# Altium schematic sheet 24. SOC DIGITAL POWER 3.SchDoc: SOC - DIGITAL POWER 3 (part 3 of 5)
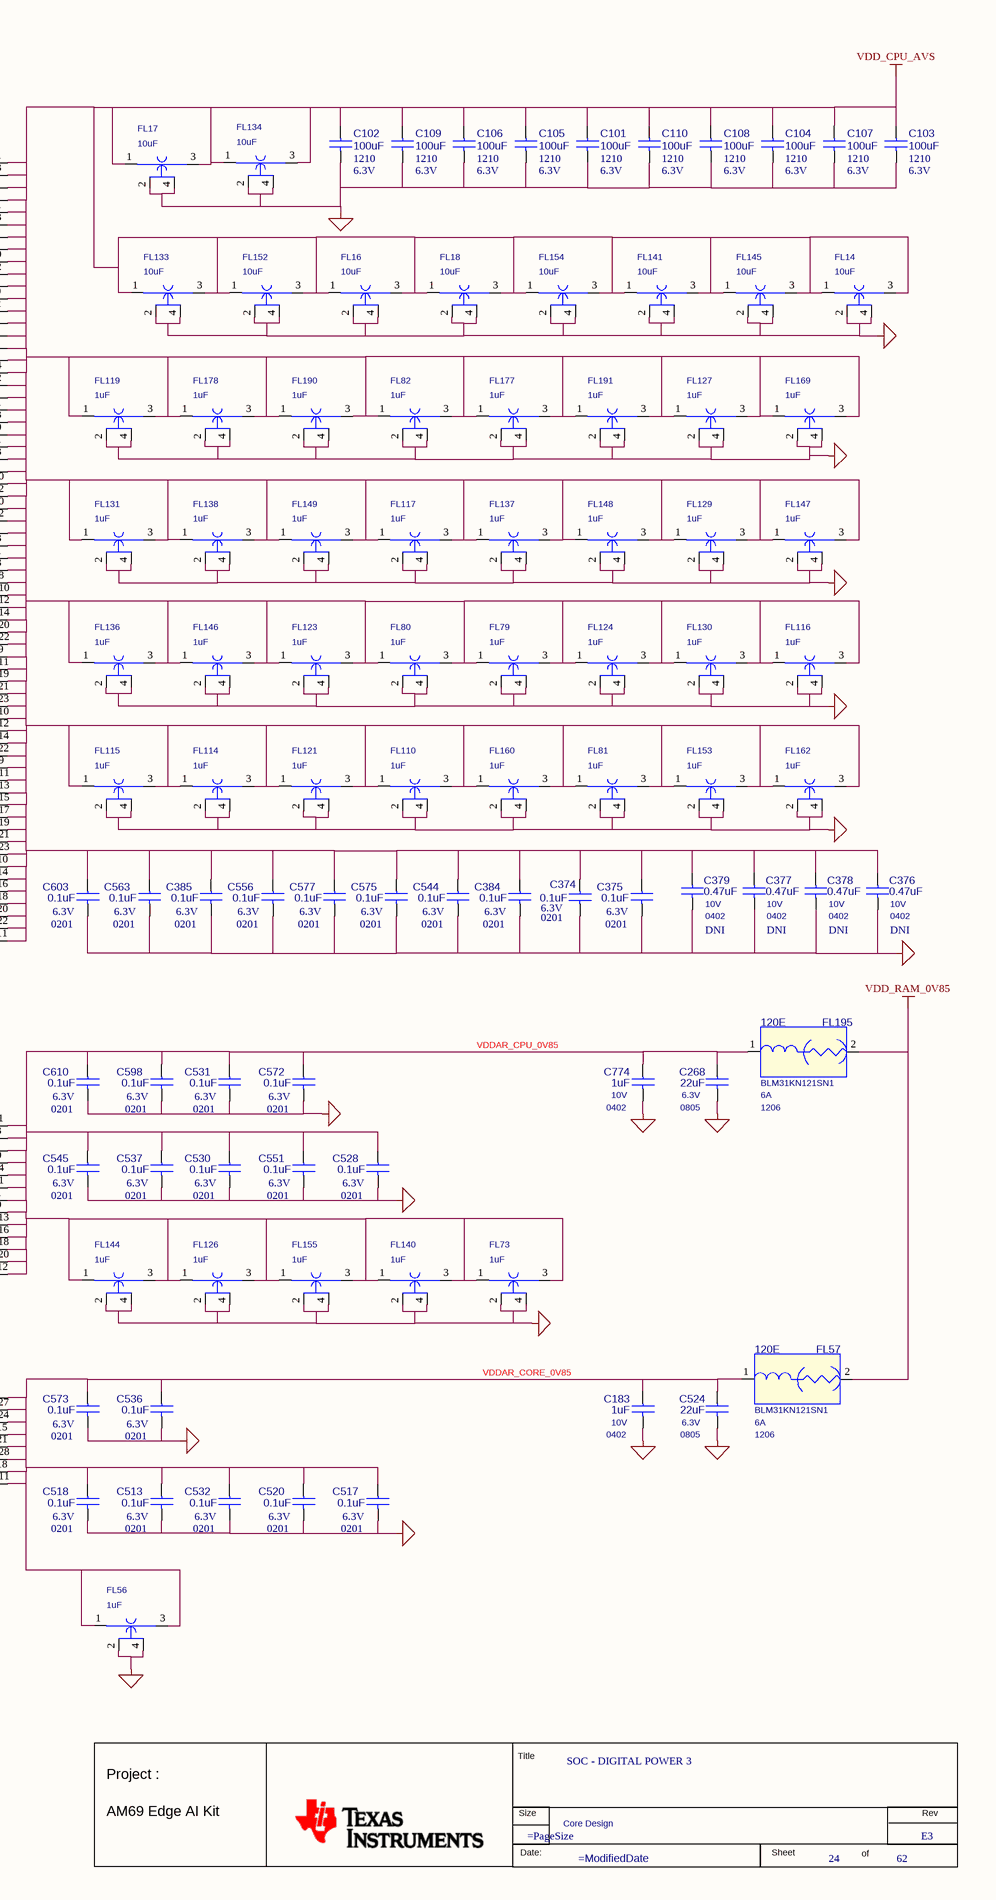
[diagram p3: 24. SOC DIGITAL POWER 3.SchDoc, right]

## Library data of the parts (continued)
C563 = CAP_Dup1: CAP CERAMIC 0.1uF 6.3V 10% X7S AUTO 0201; Part Reference: C563; Manufacturer: MURATA; Mistral Part No: 120018100001-R; Mfr_part_number: GCM033C70J104KE02D; Part_type: CAPACITORS\CERAMIC; Project: TI_J7_SVB-DUT; Wattage: NA; Customs_HS_Code: 85322990; Custom_Duty: 15%; Value: 0.1uF; PCB Footprint: CAP0201_0-5; Footprint Ref: CAP0201_0-5; Mfr_name: MURATA; Tolerance: 10%; Distributor_name: NA; Distributor_part_number: NA; Library Ref: CAP; Height: 0.33MM; Weight: NA; Temperature: -55°C+125°C; Datasheet: Y:\MIS_DATABASE\DATASHEETS\CAPACITORS\MURATA-GCM-SER.PDF; Crtd /date: MANIRAJA/011018; Chkd/date: MANIRAJA/011018; MECHANICAL 3D STEP FILE: CAP0201_0-5; Library Path: Y:\MIS_DATABASE\Library\ALTIUM_TOOL\SCHEMATICS_PARTS\MS_DISCRETE_Library.schlib; Footprint Path: Y:\MIS_DATABASE\Library\ALTIUM_TOOL\PCB_FOOTPRINTS\Altium_Footprint_Lib.PcbLib
C569 = CAP_Dup1: CAP CERAMIC 0.1uF 6.3V 10% X7S AUTO 0201; Part Reference: C569; Manufacturer: MURATA; Part_type: CAPACITORS\CERAMIC; Mfr_part_number: GCM033C70J104KE02D; Mistral Part No: 120018100001-R; Custom_Duty: 15%; Customs_HS_Code: 85322990; Wattage: NA; Project: TI_J7_SVB-DUT; Value: 0.1uF; PCB Footprint: CAP0201_0-5; Footprint Path: Y:\MIS_DATABASE\Library\ALTIUM_TOOL\PCB_FOOTPRINTS\Altium_Footprint_Lib.PcbLib; Library Path: Y:\MIS_DATABASE\Library\ALTIUM_TOOL\SCHEMATICS_PARTS\MS_DISCRETE_Library.schlib; MECHANICAL 3D STEP FILE: CAP0201_0-5; Chkd/date: MANIRAJA/011018; Crtd /date: MANIRAJA/011018; Datasheet: Y:\MIS_DATABASE\DATASHEETS\CAPACITORS\MURATA-GCM-SER.PDF; Temperature: -55°C+125°C; Weight: NA; Height: 0.33MM; Library Ref: CAP; Distributor_part_number: NA; Distributor_name: NA; Tolerance: 10%; Mfr_name: MURATA; Footprint Ref: CAP0201_0-5
C572 = CAP_Dup1: CAP CERAMIC 0.1uF 6.3V 10% X7S AUTO 0201; Part Reference: C572; Manufacturer: MURATA; Mistral Part No: 120018100001-R; Mfr_part_number: GCM033C70J104KE02D; Part_type: CAPACITORS\CERAMIC; Project: TI_J7_SVB-DUT; Wattage: NA; Customs_HS_Code: 85322990; Custom_Duty: 15%; Value: 0.1uF; PCB Footprint: CAP0201_0-5; Footprint Ref: CAP0201_0-5; Mfr_name: MURATA; Tolerance: 10%; Distributor_name: NA; Distributor_part_number: NA; Library Ref: CAP; Height: 0.33MM; Weight: NA; Temperature: -55°C+125°C; Datasheet: Y:\MIS_DATABASE\DATASHEETS\CAPACITORS\MURATA-GCM-SER.PDF; Crtd /date: MANIRAJA/011018; Chkd/date: MANIRAJA/011018; MECHANICAL 3D STEP FILE: CAP0201_0-5; Library Path: Y:\MIS_DATABASE\Library\ALTIUM_TOOL\SCHEMATICS_PARTS\MS_DISCRETE_Library.schlib; Footprint Path: Y:\MIS_DATABASE\Library\ALTIUM_TOOL\PCB_FOOTPRINTS\Altium_Footprint_Lib.PcbLib
C573 = CAP_Dup1: CAP CERAMIC 0.1uF 6.3V 10% X7S AUTO 0201; Part Reference: C573; Manufacturer: MURATA; Part_type: CAPACITORS\CERAMIC; Mfr_part_number: GCM033C70J104KE02D; Mistral Part No: 120018100001-R; Custom_Duty: 15%; Customs_HS_Code: 85322990; Wattage: NA; Project: TI_J7_SVB-DUT; Value: 0.1uF; PCB Footprint: CAP0201_0-5; Footprint Path: Y:\MIS_DATABASE\Library\ALTIUM_TOOL\PCB_FOOTPRINTS\Altium_Footprint_Lib.PcbLib; Library Path: Y:\MIS_DATABASE\Library\ALTIUM_TOOL\SCHEMATICS_PARTS\MS_DISCRETE_Library.schlib; MECHANICAL 3D STEP FILE: CAP0201_0-5; Chkd/date: MANIRAJA/011018; Crtd /date: MANIRAJA/011018; Datasheet: Y:\MIS_DATABASE\DATASHEETS\CAPACITORS\MURATA-GCM-SER.PDF; Temperature: -55°C+125°C; Weight: NA; Height: 0.33MM; Library Ref: CAP; Distributor_part_number: NA; Distributor_name: NA; Tolerance: 10%; Mfr_name: MURATA; Footprint Ref: CAP0201_0-5
C575 = CAP_Dup1: CAP CERAMIC 0.1uF 6.3V 10% X7S AUTO 0201; Part Reference: C575; Manufacturer: MURATA; Part_type: CAPACITORS\CERAMIC; Mfr_part_number: GCM033C70J104KE02D; Mistral Part No: 120018100001-R; Custom_Duty: 15%; Customs_HS_Code: 85322990; Wattage: NA; Project: TI_J7_SVB-DUT; Value: 0.1uF; PCB Footprint: CAP0201_0-5; Footprint Path: Y:\MIS_DATABASE\Library\ALTIUM_TOOL\PCB_FOOTPRINTS\Altium_Footprint_Lib.PcbLib; Library Path: Y:\MIS_DATABASE\Library\ALTIUM_TOOL\SCHEMATICS_PARTS\MS_DISCRETE_Library.schlib; MECHANICAL 3D STEP FILE: CAP0201_0-5; Chkd/date: MANIRAJA/011018; Crtd /date: MANIRAJA/011018; Datasheet: Y:\MIS_DATABASE\DATASHEETS\CAPACITORS\MURATA-GCM-SER.PDF; Temperature: -55°C+125°C; Weight: NA; Height: 0.33MM; Library Ref: CAP; Distributor_part_number: NA; Distributor_name: NA; Tolerance: 10%; Mfr_name: MURATA; Footprint Ref: CAP0201_0-5
C577 = CAP_Dup1: CAP CERAMIC 0.1uF 6.3V 10% X7S AUTO 0201; Part Reference: C577; Manufacturer: MURATA; Mistral Part No: 120018100001-R; Mfr_part_number: GCM033C70J104KE02D; Part_type: CAPACITORS\CERAMIC; Project: TI_J7_SVB-DUT; Wattage: NA; Customs_HS_Code: 85322990; Custom_Duty: 15%; Value: 0.1uF; PCB Footprint: CAP0201_0-5; Footprint Ref: CAP0201_0-5; Mfr_name: MURATA; Tolerance: 10%; Distributor_name: NA; Distributor_part_number: NA; Library Ref: CAP; Height: 0.33MM; Weight: NA; Temperature: -55°C+125°C; Datasheet: Y:\MIS_DATABASE\DATASHEETS\CAPACITORS\MURATA-GCM-SER.PDF; Crtd /date: MANIRAJA/011018; Chkd/date: MANIRAJA/011018; MECHANICAL 3D STEP FILE: CAP0201_0-5; Library Path: Y:\MIS_DATABASE\Library\ALTIUM_TOOL\SCHEMATICS_PARTS\MS_DISCRETE_Library.schlib; Footprint Path: Y:\MIS_DATABASE\Library\ALTIUM_TOOL\PCB_FOOTPRINTS\Altium_Footprint_Lib.PcbLib
C584 = CAP_Dup1: CAP CERAMIC 0.1uF 6.3V 10% X7S AUTO 0201; Part Reference: C584; Manufacturer: MURATA; Part_type: CAPACITORS\CERAMIC; Mfr_part_number: GCM033C70J104KE02D; Mistral Part No: 120018100001-R; Custom_Duty: 15%; Customs_HS_Code: 85322990; Wattage: NA; Project: TI_J7_SVB-DUT; Value: 0.1uF; PCB Footprint: CAP0201_0-5; Footprint Path: Y:\MIS_DATABASE\Library\ALTIUM_TOOL\PCB_FOOTPRINTS\Altium_Footprint_Lib.PcbLib; Library Path: Y:\MIS_DATABASE\Library\ALTIUM_TOOL\SCHEMATICS_PARTS\MS_DISCRETE_Library.schlib; MECHANICAL 3D STEP FILE: CAP0201_0-5; Chkd/date: MANIRAJA/011018; Crtd /date: MANIRAJA/011018; Datasheet: Y:\MIS_DATABASE\DATASHEETS\CAPACITORS\MURATA-GCM-SER.PDF; Temperature: -55°C+125°C; Weight: NA; Height: 0.33MM; Library Ref: CAP; Distributor_part_number: NA; Distributor_name: NA; Tolerance: 10%; Mfr_name: MURATA; Footprint Ref: CAP0201_0-5
C585 = CAP_Dup1: CAP CERAMIC 0.1uF 6.3V 10% X7S AUTO 0201; Part Reference: C585; Manufacturer: MURATA; Part_type: CAPACITORS\CERAMIC; Mfr_part_number: GCM033C70J104KE02D; Mistral Part No: 120018100001-R; Custom_Duty: 15%; Customs_HS_Code: 85322990; Wattage: NA; Project: TI_J7_SVB-DUT; Value: 0.1uF; PCB Footprint: CAP0201_0-5; Footprint Path: Y:\MIS_DATABASE\Library\ALTIUM_TOOL\PCB_FOOTPRINTS\Altium_Footprint_Lib.PcbLib; Library Path: Y:\MIS_DATABASE\Library\ALTIUM_TOOL\SCHEMATICS_PARTS\MS_DISCRETE_Library.schlib; MECHANICAL 3D STEP FILE: CAP0201_0-5; Chkd/date: MANIRAJA/011018; Crtd /date: MANIRAJA/011018; Datasheet: Y:\MIS_DATABASE\DATASHEETS\CAPACITORS\MURATA-GCM-SER.PDF; Temperature: -55°C+125°C; Weight: NA; Height: 0.33MM; Library Ref: CAP; Distributor_part_number: NA; Distributor_name: NA; Tolerance: 10%; Mfr_name: MURATA; Footprint Ref: CAP0201_0-5
C594 = CAP_Dup1: CAP CERAMIC 0.1uF 6.3V 10% X7S AUTO 0201; Part Reference: C594; Manufacturer: MURATA; Mistral Part No: 120018100001-R; Mfr_part_number: GCM033C70J104KE02D; Part_type: CAPACITORS\CERAMIC; Project: TI_J7_SVB-DUT; Wattage: NA; Customs_HS_Code: 85322990; Custom_Duty: 15%; Value: 0.1uF; PCB Footprint: CAP0201_0-5; Footprint Ref: CAP0201_0-5; Mfr_name: MURATA; Tolerance: 10%; Distributor_name: NA; Distributor_part_number: NA; Library Ref: CAP; Height: 0.33MM; Weight: NA; Temperature: -55°C+125°C; Datasheet: Y:\MIS_DATABASE\DATASHEETS\CAPACITORS\MURATA-GCM-SER.PDF; Crtd /date: MANIRAJA/011018; Chkd/date: MANIRAJA/011018; MECHANICAL 3D STEP FILE: CAP0201_0-5; Library Path: Y:\MIS_DATABASE\Library\ALTIUM_TOOL\SCHEMATICS_PARTS\MS_DISCRETE_Library.schlib; Footprint Path: Y:\MIS_DATABASE\Library\ALTIUM_TOOL\PCB_FOOTPRINTS\Altium_Footprint_Lib.PcbLib
C596 = CAP_Dup1: CAP CERAMIC 0.1uF 6.3V 10% X7S AUTO 0201; Part Reference: C596; Manufacturer: MURATA; Part_type: CAPACITORS\CERAMIC; Mfr_part_number: GCM033C70J104KE02D; Mistral Part No: 120018100001-R; Custom_Duty: 15%; Customs_HS_Code: 85322990; Wattage: NA; Project: TI_J7_SVB-DUT; Value: 0.1uF; PCB Footprint: CAP0201_0-5; Footprint Path: Y:\MIS_DATABASE\Library\ALTIUM_TOOL\PCB_FOOTPRINTS\Altium_Footprint_Lib.PcbLib; Library Path: Y:\MIS_DATABASE\Library\ALTIUM_TOOL\SCHEMATICS_PARTS\MS_DISCRETE_Library.schlib; MECHANICAL 3D STEP FILE: CAP0201_0-5; Chkd/date: MANIRAJA/011018; Crtd /date: MANIRAJA/011018; Datasheet: Y:\MIS_DATABASE\DATASHEETS\CAPACITORS\MURATA-GCM-SER.PDF; Temperature: -55°C+125°C; Weight: NA; Height: 0.33MM; Library Ref: CAP; Distributor_part_number: NA; Distributor_name: NA; Tolerance: 10%; Mfr_name: MURATA; Footprint Ref: CAP0201_0-5
C598 = CAP_Dup1: CAP CERAMIC 0.1uF 6.3V 10% X7S AUTO 0201; Part Reference: C598; Manufacturer: MURATA; Mistral Part No: 120018100001-R; Mfr_part_number: GCM033C70J104KE02D; Part_type: CAPACITORS\CERAMIC; Project: TI_J7_SVB-DUT; Wattage: NA; Customs_HS_Code: 85322990; Custom_Duty: 15%; Value: 0.1uF; PCB Footprint: CAP0201_0-5; Footprint Ref: CAP0201_0-5; Mfr_name: MURATA; Tolerance: 10%; Distributor_name: NA; Distributor_part_number: NA; Library Ref: CAP; Height: 0.33MM; Weight: NA; Temperature: -55°C+125°C; Datasheet: Y:\MIS_DATABASE\DATASHEETS\CAPACITORS\MURATA-GCM-SER.PDF; Crtd /date: MANIRAJA/011018; Chkd/date: MANIRAJA/011018; MECHANICAL 3D STEP FILE: CAP0201_0-5; Library Path: Y:\MIS_DATABASE\Library\ALTIUM_TOOL\SCHEMATICS_PARTS\MS_DISCRETE_Library.schlib; Footprint Path: Y:\MIS_DATABASE\Library\ALTIUM_TOOL\PCB_FOOTPRINTS\Altium_Footprint_Lib.PcbLib
C602 = CAP_Dup1: CAP CERAMIC 0.1uF 6.3V 10% X7S AUTO 0201; Part Reference: C602; Manufacturer: MURATA; Part_type: CAPACITORS\CERAMIC; Mfr_part_number: GCM033C70J104KE02D; Mistral Part No: 120018100001-R; Custom_Duty: 15%; Customs_HS_Code: 85322990; Wattage: NA; Project: TI_J7_SVB-DUT; Value: 0.1uF; PCB Footprint: CAP0201_0-5; Footprint Path: Y:\MIS_DATABASE\Library\ALTIUM_TOOL\PCB_FOOTPRINTS\Altium_Footprint_Lib.PcbLib; Library Path: Y:\MIS_DATABASE\Library\ALTIUM_TOOL\SCHEMATICS_PARTS\MS_DISCRETE_Library.schlib; MECHANICAL 3D STEP FILE: CAP0201_0-5; Chkd/date: MANIRAJA/011018; Crtd /date: MANIRAJA/011018; Datasheet: Y:\MIS_DATABASE\DATASHEETS\CAPACITORS\MURATA-GCM-SER.PDF; Temperature: -55°C+125°C; Weight: NA; Height: 0.33MM; Library Ref: CAP; Distributor_part_number: NA; Distributor_name: NA; Tolerance: 10%; Mfr_name: MURATA; Footprint Ref: CAP0201_0-5
C603 = CAP_Dup1: CAP CERAMIC 0.1uF 6.3V 10% X7S AUTO 0201; Part Reference: C603; Manufacturer: MURATA; Part_type: CAPACITORS\CERAMIC; Mfr_part_number: GCM033C70J104KE02D; Mistral Part No: 120018100001-R; Custom_Duty: 15%; Customs_HS_Code: 85322990; Wattage: NA; Project: TI_J7_SVB-DUT; Value: 0.1uF; PCB Footprint: CAP0201_0-5; Footprint Path: Y:\MIS_DATABASE\Library\ALTIUM_TOOL\PCB_FOOTPRINTS\Altium_Footprint_Lib.PcbLib; Library Path: Y:\MIS_DATABASE\Library\ALTIUM_TOOL\SCHEMATICS_PARTS\MS_DISCRETE_Library.schlib; MECHANICAL 3D STEP FILE: CAP0201_0-5; Chkd/date: MANIRAJA/011018; Crtd /date: MANIRAJA/011018; Datasheet: Y:\MIS_DATABASE\DATASHEETS\CAPACITORS\MURATA-GCM-SER.PDF; Temperature: -55°C+125°C; Weight: NA; Height: 0.33MM; Library Ref: CAP; Distributor_part_number: NA; Distributor_name: NA; Tolerance: 10%; Mfr_name: MURATA; Footprint Ref: CAP0201_0-5
C607 = CAP_Dup1: CAP CERAMIC 0.1uF 6.3V 10% X7S AUTO 0201; Part Reference: C607; Manufacturer: MURATA; Mistral Part No: 120018100001-R; Mfr_part_number: GCM033C70J104KE02D; Part_type: CAPACITORS\CERAMIC; Project: TI_J7_SVB-DUT; Wattage: NA; Customs_HS_Code: 85322990; Custom_Duty: 15%; Value: 0.1uF; PCB Footprint: CAP0201_0-5; Footprint Ref: CAP0201_0-5; Mfr_name: MURATA; Tolerance: 10%; Distributor_name: NA; Distributor_part_number: NA; Library Ref: CAP; Height: 0.33MM; Weight: NA; Temperature: -55°C+125°C; Datasheet: Y:\MIS_DATABASE\DATASHEETS\CAPACITORS\MURATA-GCM-SER.PDF; Crtd /date: MANIRAJA/011018; Chkd/date: MANIRAJA/011018; MECHANICAL 3D STEP FILE: CAP0201_0-5; Library Path: Y:\MIS_DATABASE\Library\ALTIUM_TOOL\SCHEMATICS_PARTS\MS_DISCRETE_Library.schlib; Footprint Path: Y:\MIS_DATABASE\Library\ALTIUM_TOOL\PCB_FOOTPRINTS\Altium_Footprint_Lib.PcbLib
C610 = CAP_Dup1: CAP CERAMIC 0.1uF 6.3V 10% X7S AUTO 0201; Part Reference: C610; Manufacturer: MURATA; Mistral Part No: 120018100001-R; Mfr_part_number: GCM033C70J104KE02D; Part_type: CAPACITORS\CERAMIC; Project: TI_J7_SVB-DUT; Wattage: NA; Customs_HS_Code: 85322990; Custom_Duty: 15%; Value: 0.1uF; PCB Footprint: CAP0201_0-5; Footprint Ref: CAP0201_0-5; Mfr_name: MURATA; Tolerance: 10%; Distributor_name: NA; Distributor_part_number: NA; Library Ref: CAP; Height: 0.33MM; Weight: NA; Temperature: -55°C+125°C; Datasheet: Y:\MIS_DATABASE\DATASHEETS\CAPACITORS\MURATA-GCM-SER.PDF; Crtd /date: MANIRAJA/011018; Chkd/date: MANIRAJA/011018; MECHANICAL 3D STEP FILE: CAP0201_0-5; Library Path: Y:\MIS_DATABASE\Library\ALTIUM_TOOL\SCHEMATICS_PARTS\MS_DISCRETE_Library.schlib; Footprint Path: Y:\MIS_DATABASE\Library\ALTIUM_TOOL\PCB_FOOTPRINTS\Altium_Footprint_Lib.PcbLib
C612 = CAP_Dup1: CAP CERAMIC 0.1uF 6.3V 10% X7S AUTO 0201; Part Reference: C612; Part_type: CAPACITORS\CERAMIC; Mfr_part_number: GCM033C70J104KE02D; Mfr_name: MURATA; Mistral Part No: 120018100001-R; Custom_Duty: 15%; Customs_HS_Code: 85322990; Wattage: NA; Project: TI_J7_SVB-DUT; Value: 0.1uF; PCB Footprint: CAP0201_0-5; Footprint Path: Y:\MIS_DATABASE\Library\ALTIUM_TOOL\PCB_FOOTPRINTS\Altium_Footprint_Lib.PcbLib; Library Path: Y:\MIS_DATABASE\Library\ALTIUM_TOOL\SCHEMATICS_PARTS\MS_DISCRETE_Library.schlib; MECHANICAL 3D STEP FILE: CAP0201_0-5; Chkd/date: MANIRAJA/011018; Crtd /date: MANIRAJA/011018; Datasheet: Y:\MIS_DATABASE\DATASHEETS\CAPACITORS\MURATA-GCM-SER.PDF; Temperature: -55°C+125°C; Weight: NA; Height: 0.33MM; Library Ref: CAP; Distributor_part_number: NA; Distributor_name: NA; Tolerance: 10%; Footprint Ref: CAP0201_0-5; Manufacturer: MURATA
C615 = CAP_Dup1: CAP CERAMIC 0.1uF 6.3V 10% X7S AUTO 0201; Part Reference: C615; Manufacturer: MURATA; Mistral Part No: 120018100001-R; Mfr_part_number: GCM033C70J104KE02D; Part_type: CAPACITORS\CERAMIC; Project: TI_J7_SVB-DUT; Wattage: NA; Customs_HS_Code: 85322990; Custom_Duty: 15%; Value: 0.1uF; PCB Footprint: CAP0201_0-5; Footprint Ref: CAP0201_0-5; Mfr_name: MURATA; Tolerance: 10%; Distributor_name: NA; Distributor_part_number: NA; Library Ref: CAP; Height: 0.33MM; Weight: NA; Temperature: -55°C+125°C; Datasheet: Y:\MIS_DATABASE\DATASHEETS\CAPACITORS\MURATA-GCM-SER.PDF; Crtd /date: MANIRAJA/011018; Chkd/date: MANIRAJA/011018; MECHANICAL 3D STEP FILE: CAP0201_0-5; Library Path: Y:\MIS_DATABASE\Library\ALTIUM_TOOL\SCHEMATICS_PARTS\MS_DISCRETE_Library.schlib; Footprint Path: Y:\MIS_DATABASE\Library\ALTIUM_TOOL\PCB_FOOTPRINTS\Altium_Footprint_Lib.PcbLib
C618 = CAP_Dup1: CAP CERAMIC 0.1uF 6.3V 10% X7S AUTO 0201; Part Reference: C618; Mistral Part No: 120018100001-R; Mfr_name: MURATA; Mfr_part_number: GCM033C70J104KE02D; Part_type: CAPACITORS\CERAMIC; Project: TI_J7_SVB-DUT; Wattage: NA; Customs_HS_Code: 85322990; Custom_Duty: 15%; Value: 0.1uF; PCB Footprint: CAP0201_0-5; Footprint Ref: CAP0201_0-5; Tolerance: 10%; Distributor_name: NA; Distributor_part_number: NA; Library Ref: CAP; Height: 0.33MM; Weight: NA; Temperature: -55°C+125°C; Datasheet: Y:\MIS_DATABASE\DATASHEETS\CAPACITORS\MURATA-GCM-SER.PDF; Crtd /date: MANIRAJA/011018; Chkd/date: MANIRAJA/011018; MECHANICAL 3D STEP FILE: CAP0201_0-5; Library Path: Y:\MIS_DATABASE\Library\ALTIUM_TOOL\SCHEMATICS_PARTS\MS_DISCRETE_Library.schlib; Footprint Path: Y:\MIS_DATABASE\Library\ALTIUM_TOOL\PCB_FOOTPRINTS\Altium_Footprint_Lib.PcbLib; Manufacturer: MURATA
C628 = CAP_Dup1: CAP CERAMIC 22uF 6.3V 20% X7T AUTO 0805; Part Reference: C628; Manufacturer: MURATA; Part_type: CAPACITORS\CERAMIC; Mfr_part_number: GCM21BD70J226ME36L; Mistral Part No: 120018100065-R; Automotive Alternate_mfr_name: TDK; Automotive Alternate_mfr_part_number: CGA4J1X7T0J226M; Custom_Duty: 15%; Customs_HS_Code: 85322990; Wattage: NA; Project: TI_J7ES_EVM_SOM; Value: 22uF; PCB Footprint: CAP0805_1-25; Footprint Path: Y:\MIS_DATABASE\Library\ALTIUM_TOOL\PCB_FOOTPRINTS\Altium_Footprint_Lib.PcbLib; Library Path: Y:\MIS_DATABASE\Library\ALTIUM_TOOL\SCHEMATICS_PARTS\MS_DISCRETE_Library.schlib; MECHANICAL 3D STEP FILE: CAP0805_1-25; Chkd/date: MANIRAJA/261018; Crtd /date: ALVY/251018; Datasheet: Y:\MIS_DATABASE\DATASHEETS\CAPACITORS\GCM-SERIES.PDF; Temperature: -55°C+125°C; Weight: NA; Height: 1.25MM; Library Ref: CAP; Distributor_part_number: 81-GCM21BD70J226ME6L; Distributor_name: MOUSER; Tolerance: 20%; Mfr_name: MURATA; Footprint Ref: CAP0805_1-25
C639 = CAP_Dup1: CAP CERAMIC 1uF 10V 10% X7S AUTO 0402; Part Reference: C639; Manufacturer: MURATA; Mistral Part No: 120018090021-R; Mfr_part_number: GCM155C71A105KE38D; Part_type: CAPACITORS\CERAMIC; Project: SMART-M_SCRIPTALK_PB; Wattage: NA; Customs_HS_Code: 85322990; Custom_Duty: 15%; Value: 1uF; PCB Footprint: CAP0402_0-75; Footprint Ref: CAP0402_0-75; Mfr_name: MURATA; Tolerance: 10%; Distributor_name: DIGIKEY; Distributor_part_number: 490-13409-1-ND; Library Ref: CAP; Height: 0.70MM; Weight: 6mg; Temperature: -55°C+125°C; Datasheet: Y:\MIS_DATABASE\DATASHEETS\CAPACITORS\MURATA-GCM-SER.PDF; Crtd /date: ALVY/100918; Chkd/date: MANIRAJA/100918; MECHANICAL 3D STEP FILE: CAP0402_0-75; Library Path: Y:\MIS_DATABASE\Library\ALTIUM_TOOL\SCHEMATICS_PARTS\MS_DISCRETE_Library.schlib; Footprint Path: Y:\MIS_DATABASE\Library\ALTIUM_TOOL\PCB_FOOTPRINTS\Altium_Footprint_Lib.PcbLib
C774 = CAP_Dup1: CAP CERAMIC 1uF 10V 10% X7S AUTO 0402; Part Reference: C774; Manufacturer: MURATA; Mistral Part No: 120018090021-R; Mfr_part_number: GCM155C71A105KE38D; Part_type: CAPACITORS\CERAMIC; Project: SMART-M_SCRIPTALK_PB; Wattage: NA; Customs_HS_Code: 85322990; Custom_Duty: 15%; Value: 1uF; PCB Footprint: CAP0402_0-75; Footprint Ref: CAP0402_0-75; Mfr_name: MURATA; Tolerance: 10%; Distributor_name: DIGIKEY; Distributor_part_number: 490-13409-1-ND; Library Ref: CAP; Height: 0.70MM; Weight: 6mg; Temperature: -55°C+125°C; Datasheet: Y:\MIS_DATABASE\DATASHEETS\CAPACITORS\MURATA-GCM-SER.PDF; Crtd /date: ALVY/100918; Chkd/date: MANIRAJA/100918; MECHANICAL 3D STEP FILE: CAP0402_0-75; Library Path: Y:\MIS_DATABASE\Library\ALTIUM_TOOL\SCHEMATICS_PARTS\MS_DISCRETE_Library.schlib; Footprint Path: Y:\MIS_DATABASE\Library\ALTIUM_TOOL\PCB_FOOTPRINTS\Altium_Footprint_Lib.PcbLib
FL14 = CAP_NFM_TI: PASSIVE FILTER EMI 10uF 4V AUTO 0603; Part Reference: FL14; Mfr_part_number: NFM18HC106D0G_TI; Mfr_name: MURATA; Mistral Part No: 130018100049; Custom_Duty: 15%; Customs_HS_Code: 85412900; Wattage: NA; Project: TI_J7ES_EVM_SOM; Value: 10uF; Footprint Path: Y:\MIS_DATABASE\Library\ALTIUM_TOOL\PCB_FOOTPRINTS\Altium_Footprint_Lib.PcbLib; Library Path: Y:\MIS_DATABASE\Library\ALTIUM_TOOL\SCHEMATICS_PARTS\MS_FILTER_Library.schlib; MECHANICAL 3D STEP FILE: EMIFIL_NFM18C_0603_0-7_TI; RoHS: NA; Chkd/date: MANIRAJA/251018; Crtd /date: ALVY/251018; Datasheet: Y:\MIS_DATABASE\DATASHEETS\DISCRETES\INDUCTORS\NFM18HC-SER.PDF; Temperature: NA; Weight: NA; Height: 0.70MM; PCB Footprint: EMIFIL_NFM18C_0603_0-7_TI; Library Ref: CAP_NFM_TI; Distributor_part_number: NA; Distributor_name: NA; Package: 0603; Voltage: 4V; Tolerance: NA; Part_type: FILTER; Footprint Ref: EMIFIL_NFM18C_0603_0-7_TI
FL16 = CAP_NFM_TI: PASSIVE FILTER EMI 10uF 4V AUTO 0603; Part Reference: FL16; Mfr_part_number: NFM18HC106D0G_TI; Mfr_name: MURATA; Mistral Part No: 130018100049; Custom_Duty: 15%; Customs_HS_Code: 85412900; Wattage: NA; Project: TI_J7ES_EVM_SOM; Value: 10uF; Footprint Path: Y:\MIS_DATABASE\Library\ALTIUM_TOOL\PCB_FOOTPRINTS\Altium_Footprint_Lib.PcbLib; Library Path: Y:\MIS_DATABASE\Library\ALTIUM_TOOL\SCHEMATICS_PARTS\MS_FILTER_Library.schlib; MECHANICAL 3D STEP FILE: EMIFIL_NFM18C_0603_0-7_TI; RoHS: NA; Chkd/date: MANIRAJA/251018; Crtd /date: ALVY/251018; Datasheet: Y:\MIS_DATABASE\DATASHEETS\DISCRETES\INDUCTORS\NFM18HC-SER.PDF; Temperature: NA; Weight: NA; Height: 0.70MM; PCB Footprint: EMIFIL_NFM18C_0603_0-7_TI; Library Ref: CAP_NFM_TI; Distributor_part_number: NA; Distributor_name: NA; Package: 0603; Voltage: 4V; Tolerance: NA; Part_type: FILTER; Footprint Ref: EMIFIL_NFM18C_0603_0-7_TI
FL17 = CAP_NFM_TI: PASSIVE FILTER EMI 10uF 4V AUTO 0603; Part Reference: FL17; Mfr_part_number: NFM18HC106D0G_TI; Mfr_name: MURATA; Mistral Part No: 130018100049; Custom_Duty: 15%; Customs_HS_Code: 85412900; Wattage: NA; Project: TI_J7ES_EVM_SOM; Value: 10uF; Footprint Path: Y:\MIS_DATABASE\Library\ALTIUM_TOOL\PCB_FOOTPRINTS\Altium_Footprint_Lib.PcbLib; Library Path: Y:\MIS_DATABASE\Library\ALTIUM_TOOL\SCHEMATICS_PARTS\MS_FILTER_Library.schlib; MECHANICAL 3D STEP FILE: EMIFIL_NFM18C_0603_0-7_TI; RoHS: NA; Chkd/date: MANIRAJA/251018; Crtd /date: ALVY/251018; Datasheet: Y:\MIS_DATABASE\DATASHEETS\DISCRETES\INDUCTORS\NFM18HC-SER.PDF; Temperature: NA; Weight: NA; Height: 0.70MM; PCB Footprint: EMIFIL_NFM18C_0603_0-7_TI; Library Ref: CAP_NFM_TI; Distributor_part_number: NA; Distributor_name: NA; Package: 0603; Voltage: 4V; Tolerance: NA; Part_type: FILTER; Footprint Ref: EMIFIL_NFM18C_0603_0-7_TI
FL18 = CAP_NFM_TI: PASSIVE FILTER EMI 10uF 4V AUTO 0603; Part Reference: FL18; Mfr_part_number: NFM18HC106D0G_TI; Mfr_name: MURATA; Mistral Part No: 130018100049; Custom_Duty: 15%; Customs_HS_Code: 85412900; Wattage: NA; Project: TI_J7ES_EVM_SOM; Value: 10uF; Footprint Path: Y:\MIS_DATABASE\Library\ALTIUM_TOOL\PCB_FOOTPRINTS\Altium_Footprint_Lib.PcbLib; Library Path: Y:\MIS_DATABASE\Library\ALTIUM_TOOL\SCHEMATICS_PARTS\MS_FILTER_Library.schlib; MECHANICAL 3D STEP FILE: EMIFIL_NFM18C_0603_0-7_TI; RoHS: NA; Chkd/date: MANIRAJA/251018; Crtd /date: ALVY/251018; Datasheet: Y:\MIS_DATABASE\DATASHEETS\DISCRETES\INDUCTORS\NFM18HC-SER.PDF; Temperature: NA; Weight: NA; Height: 0.70MM; PCB Footprint: EMIFIL_NFM18C_0603_0-7_TI; Library Ref: CAP_NFM_TI; Distributor_part_number: NA; Distributor_name: NA; Package: 0603; Voltage: 4V; Tolerance: NA; Part_type: FILTER; Footprint Ref: EMIFIL_NFM18C_0603_0-7_TI
FL42 = CAP_NFM_TI: PASSIVE FILTER EMI 10uF 4V AUTO 0603; Part Reference: FL42; Mfr_part_number: NFM18HC106D0G_TI; Mfr_name: MURATA; Mistral Part No: 130018100049; Custom_Duty: 15%; Customs_HS_Code: 85412900; Wattage: NA; Project: TI_J7ES_EVM_SOM; Value: 10uF; Footprint Path: Y:\MIS_DATABASE\Library\ALTIUM_TOOL\PCB_FOOTPRINTS\Altium_Footprint_Lib.PcbLib; Library Path: Y:\MIS_DATABASE\Library\ALTIUM_TOOL\SCHEMATICS_PARTS\MS_FILTER_Library.schlib; MECHANICAL 3D STEP FILE: EMIFIL_NFM18C_0603_0-7_TI; RoHS: NA; Chkd/date: MANIRAJA/251018; Crtd /date: ALVY/251018; Datasheet: Y:\MIS_DATABASE\DATASHEETS\DISCRETES\INDUCTORS\NFM18HC-SER.PDF; Temperature: NA; Weight: NA; Height: 0.70MM; PCB Footprint: EMIFIL_NFM18C_0603_0-7_TI; Library Ref: CAP_NFM_TI; Distributor_part_number: NA; Distributor_name: NA; Package: 0603; Voltage: 4V; Tolerance: NA; Part_type: FILTER; Footprint Ref: EMIFIL_NFM18C_0603_0-7_TI
FL43 = CAP_NFM_TI: PASSIVE FILTER EMI 10uF 4V AUTO 0603; Part Reference: FL43; Mfr_part_number: NFM18HC106D0G_TI; Mfr_name: MURATA; Mistral Part No: 130018100049; Custom_Duty: 15%; Customs_HS_Code: 85412900; Wattage: NA; Project: TI_J7ES_EVM_SOM; Value: 10uF; Footprint Path: Y:\MIS_DATABASE\Library\ALTIUM_TOOL\PCB_FOOTPRINTS\Altium_Footprint_Lib.PcbLib; Library Path: Y:\MIS_DATABASE\Library\ALTIUM_TOOL\SCHEMATICS_PARTS\MS_FILTER_Library.schlib; MECHANICAL 3D STEP FILE: EMIFIL_NFM18C_0603_0-7_TI; RoHS: NA; Chkd/date: MANIRAJA/251018; Crtd /date: ALVY/251018; Datasheet: Y:\MIS_DATABASE\DATASHEETS\DISCRETES\INDUCTORS\NFM18HC-SER.PDF; Temperature: NA; Weight: NA; Height: 0.70MM; PCB Footprint: EMIFIL_NFM18C_0603_0-7_TI; Library Ref: CAP_NFM_TI; Distributor_part_number: NA; Distributor_name: NA; Package: 0603; Voltage: 4V; Tolerance: NA; Part_type: FILTER; Footprint Ref: EMIFIL_NFM18C_0603_0-7_TI
FL44 = CAP_NFM_TI: PASSIVE FILTER EMI 10uF 4V AUTO 0603; Part Reference: FL44; Mfr_part_number: NFM18HC106D0G_TI; Mfr_name: MURATA; Mistral Part No: 130018100049; Custom_Duty: 15%; Customs_HS_Code: 85412900; Wattage: NA; Project: TI_J7ES_EVM_SOM; Value: 10uF; Footprint Path: Y:\MIS_DATABASE\Library\ALTIUM_TOOL\PCB_FOOTPRINTS\Altium_Footprint_Lib.PcbLib; Library Path: Y:\MIS_DATABASE\Library\ALTIUM_TOOL\SCHEMATICS_PARTS\MS_FILTER_Library.schlib; MECHANICAL 3D STEP FILE: EMIFIL_NFM18C_0603_0-7_TI; RoHS: NA; Chkd/date: MANIRAJA/251018; Crtd /date: ALVY/251018; Datasheet: Y:\MIS_DATABASE\DATASHEETS\DISCRETES\INDUCTORS\NFM18HC-SER.PDF; Temperature: NA; Weight: NA; Height: 0.70MM; PCB Footprint: EMIFIL_NFM18C_0603_0-7_TI; Library Ref: CAP_NFM_TI; Distributor_part_number: NA; Distributor_name: NA; Package: 0603; Voltage: 4V; Tolerance: NA; Part_type: FILTER; Footprint Ref: EMIFIL_NFM18C_0603_0-7_TI
FL45 = CAP_NFM_TI: PASSIVE FILTER EMI 10uF 4V AUTO 0603; Part Reference: FL45; Mistral Part No: 130018100049; Mfr_name: MURATA; Mfr_part_number: NFM18HC106D0G_TI; Project: TI_J7ES_EVM_SOM; Tolerance: NA; Customs_HS_Code: 85412900; Custom_Duty: 15%; Value: 10uF; PCB Footprint: EMIFIL_NFM18C_0603_0-7_TI; Footprint Ref: EMIFIL_NFM18C_0603_0-7_TI; Part_type: FILTER; Voltage: 4V; Wattage: NA; Package: 0603; Distributor_name: NA; Distributor_part_number: NA; Library Ref: CAP_NFM_TI; Height: 0.70MM; Weight: NA; Temperature: NA; Datasheet: Y:\MIS_DATABASE\DATASHEETS\DISCRETES\INDUCTORS\NFM18HC-SER.PDF; Crtd /date: ALVY/251018; Chkd/date: MANIRAJA/251018; RoHS: NA; MECHANICAL 3D STEP FILE: EMIFIL_NFM18C_0603_0-7_TI; Library Path: Y:\MIS_DATABASE\Library\ALTIUM_TOOL\SCHEMATICS_PARTS\MS_FILTER_Library.schlib; Footprint Path: Y:\MIS_DATABASE\Library\ALTIUM_TOOL\PCB_FOOTPRINTS\Altium_Footprint_Lib.PcbLib
FL46 = CAP_NFM_TI: PASSIVE FILTER EMI 10uF 4V AUTO 0603; Part Reference: FL46; Mistral Part No: 130018100049; Mfr_name: MURATA; Mfr_part_number: NFM18HC106D0G_TI; Project: TI_J7ES_EVM_SOM; Tolerance: NA; Customs_HS_Code: 85412900; Custom_Duty: 15%; Value: 10uF; PCB Footprint: EMIFIL_NFM18C_0603_0-7_TI; Footprint Ref: EMIFIL_NFM18C_0603_0-7_TI; Part_type: FILTER; Voltage: 4V; Wattage: NA; Package: 0603; Distributor_name: NA; Distributor_part_number: NA; Library Ref: CAP_NFM_TI; Height: 0.70MM; Weight: NA; Temperature: NA; Datasheet: Y:\MIS_DATABASE\DATASHEETS\DISCRETES\INDUCTORS\NFM18HC-SER.PDF; Crtd /date: ALVY/251018; Chkd/date: MANIRAJA/251018; RoHS: NA; MECHANICAL 3D STEP FILE: EMIFIL_NFM18C_0603_0-7_TI; Library Path: Y:\MIS_DATABASE\Library\ALTIUM_TOOL\SCHEMATICS_PARTS\MS_FILTER_Library.schlib; Footprint Path: Y:\MIS_DATABASE\Library\ALTIUM_TOOL\PCB_FOOTPRINTS\Altium_Footprint_Lib.PcbLib
FL47 = CAP_NFM_TI: PASSIVE FILTER EMI 1uF 4V AUTO 0402; Part Reference: FL47; Mfr_part_number: NFM15HC105D0G_TI; Mfr_name: MURATA; Mistral Part No: 130018100050; Custom_Duty: 15%; Customs_HS_Code: 85412900; Wattage: NA; Project: TI_J7ES_EVM_SOM; Value: 1uF; Footprint Path: Y:\MIS_DATABASE\Library\ALTIUM_TOOL\PCB_FOOTPRINTS\Altium_Footprint_Lib.PcbLib; Library Path: Y:\MIS_DATABASE\Library\ALTIUM_TOOL\SCHEMATICS_PARTS\MS_FILTER_Library.schlib; MECHANICAL 3D STEP FILE: EMIFIL_NFM15CC_0402_0-5_TI; RoHS: NA; Chkd/date: MANIRAJA/251018; Crtd /date: ALVY/251018; Datasheet: Y:\MIS_DATABASE\DATASHEETS\DISCRETES\INDUCTORS\NFM15CC223C1A3.PDF; Temperature: NA; Weight: NA; Height: 0.50MM; PCB Footprint: EMIFIL_NFM15CC_0402_0-5_TI; Library Ref: CAP_NFM_TI; Distributor_part_number: NA; Distributor_name: NA; Package: 0402; Voltage: 4V; Tolerance: NA; Part_type: FILTER; Footprint Ref: EMIFIL_NFM15CC_0402_0-5_TI
FL48 = CAP_NFM_TI: PASSIVE FILTER EMI 1uF 4V AUTO 0402; Part Reference: FL48; Mfr_part_number: NFM15HC105D0G_TI; Mfr_name: MURATA; Mistral Part No: 130018100050; Custom_Duty: 15%; Customs_HS_Code: 85412900; Wattage: NA; Project: TI_J7ES_EVM_SOM; Value: 1uF; Footprint Path: Y:\MIS_DATABASE\Library\ALTIUM_TOOL\PCB_FOOTPRINTS\Altium_Footprint_Lib.PcbLib; Library Path: Y:\MIS_DATABASE\Library\ALTIUM_TOOL\SCHEMATICS_PARTS\MS_FILTER_Library.schlib; MECHANICAL 3D STEP FILE: EMIFIL_NFM15CC_0402_0-5_TI; RoHS: NA; Chkd/date: MANIRAJA/251018; Crtd /date: ALVY/251018; Datasheet: Y:\MIS_DATABASE\DATASHEETS\DISCRETES\INDUCTORS\NFM15CC223C1A3.PDF; Temperature: NA; Weight: NA; Height: 0.50MM; PCB Footprint: EMIFIL_NFM15CC_0402_0-5_TI; Library Ref: CAP_NFM_TI; Distributor_part_number: NA; Distributor_name: NA; Package: 0402; Voltage: 4V; Tolerance: NA; Part_type: FILTER; Footprint Ref: EMIFIL_NFM15CC_0402_0-5_TI
FL49 = CAP_NFM_TI: PASSIVE FILTER EMI 1uF 4V AUTO 0402; Part Reference: FL49; Mfr_part_number: NFM15HC105D0G_TI; Mfr_name: MURATA; Mistral Part No: 130018100050; Custom_Duty: 15%; Customs_HS_Code: 85412900; Wattage: NA; Project: TI_J7ES_EVM_SOM; Value: 1uF; Footprint Path: Y:\MIS_DATABASE\Library\ALTIUM_TOOL\PCB_FOOTPRINTS\Altium_Footprint_Lib.PcbLib; Library Path: Y:\MIS_DATABASE\Library\ALTIUM_TOOL\SCHEMATICS_PARTS\MS_FILTER_Library.schlib; MECHANICAL 3D STEP FILE: EMIFIL_NFM15CC_0402_0-5_TI; RoHS: NA; Chkd/date: MANIRAJA/251018; Crtd /date: ALVY/251018; Datasheet: Y:\MIS_DATABASE\DATASHEETS\DISCRETES\INDUCTORS\NFM15CC223C1A3.PDF; Temperature: NA; Weight: NA; Height: 0.50MM; PCB Footprint: EMIFIL_NFM15CC_0402_0-5_TI; Library Ref: CAP_NFM_TI; Distributor_part_number: NA; Distributor_name: NA; Package: 0402; Voltage: 4V; Tolerance: NA; Part_type: FILTER; Footprint Ref: EMIFIL_NFM15CC_0402_0-5_TI
FL50 = CAP_NFM_TI: PASSIVE FILTER EMI 1uF 4V AUTO 0402; Part Reference: FL50; Mfr_part_number: NFM15HC105D0G_TI; Mfr_name: MURATA; Mistral Part No: 130018100050; Custom_Duty: 15%; Customs_HS_Code: 85412900; Wattage: NA; Project: TI_J7ES_EVM_SOM; Value: 1uF; Footprint Path: Y:\MIS_DATABASE\Library\ALTIUM_TOOL\PCB_FOOTPRINTS\Altium_Footprint_Lib.PcbLib; Library Path: Y:\MIS_DATABASE\Library\ALTIUM_TOOL\SCHEMATICS_PARTS\MS_FILTER_Library.schlib; MECHANICAL 3D STEP FILE: EMIFIL_NFM15CC_0402_0-5_TI; RoHS: NA; Chkd/date: MANIRAJA/251018; Crtd /date: ALVY/251018; Datasheet: Y:\MIS_DATABASE\DATASHEETS\DISCRETES\INDUCTORS\NFM15CC223C1A3.PDF; Temperature: NA; Weight: NA; Height: 0.50MM; PCB Footprint: EMIFIL_NFM15CC_0402_0-5_TI; Library Ref: CAP_NFM_TI; Distributor_part_number: NA; Distributor_name: NA; Package: 0402; Voltage: 4V; Tolerance: NA; Part_type: FILTER; Footprint Ref: EMIFIL_NFM15CC_0402_0-5_TI
FL51 = CAP_NFM_TI: PASSIVE FILTER EMI 10uF 4V AUTO 0603; Part Reference: FL51; Mfr_part_number: NFM18HC106D0G_TI; Mfr_name: MURATA; Mistral Part No: 130018100049; Custom_Duty: 15%; Customs_HS_Code: 85412900; Wattage: NA; Project: TI_J7ES_EVM_SOM; Value: 10uF; Footprint Path: Y:\MIS_DATABASE\Library\ALTIUM_TOOL\PCB_FOOTPRINTS\Altium_Footprint_Lib.PcbLib; Library Path: Y:\MIS_DATABASE\Library\ALTIUM_TOOL\SCHEMATICS_PARTS\MS_FILTER_Library.schlib; MECHANICAL 3D STEP FILE: EMIFIL_NFM18C_0603_0-7_TI; RoHS: NA; Chkd/date: MANIRAJA/251018; Crtd /date: ALVY/251018; Datasheet: Y:\MIS_DATABASE\DATASHEETS\DISCRETES\INDUCTORS\NFM18HC-SER.PDF; Temperature: NA; Weight: NA; Height: 0.70MM; PCB Footprint: EMIFIL_NFM18C_0603_0-7_TI; Library Ref: CAP_NFM_TI; Distributor_part_number: NA; Distributor_name: NA; Package: 0603; Voltage: 4V; Tolerance: NA; Part_type: FILTER; Footprint Ref: EMIFIL_NFM18C_0603_0-7_TI
FL56 = CAP_NFM_TI: PASSIVE FILTER EMI 1uF 4V AUTO 0402; Part Reference: FL56; Mfr_part_number: NFM15HC105D0G_TI; Mfr_name: MURATA; Mistral Part No: 130018100050; Custom_Duty: 15%; Customs_HS_Code: 85412900; Wattage: NA; Project: TI_J7ES_EVM_SOM; Value: 1uF; Footprint Path: Y:\MIS_DATABASE\Library\ALTIUM_TOOL\PCB_FOOTPRINTS\Altium_Footprint_Lib.PcbLib; Library Path: Y:\MIS_DATABASE\Library\ALTIUM_TOOL\SCHEMATICS_PARTS\MS_FILTER_Library.schlib; MECHANICAL 3D STEP FILE: EMIFIL_NFM15CC_0402_0-5_TI; RoHS: NA; Chkd/date: MANIRAJA/251018; Crtd /date: ALVY/251018; Datasheet: Y:\MIS_DATABASE\DATASHEETS\DISCRETES\INDUCTORS\NFM15CC223C1A3.PDF; Temperature: NA; Weight: NA; Height: 0.50MM; PCB Footprint: EMIFIL_NFM15CC_0402_0-5_TI; Library Ref: CAP_NFM_TI; Distributor_part_number: NA; Distributor_name: NA; Package: 0402; Voltage: 4V; Tolerance: NA; Part_type: FILTER; Footprint Ref: EMIFIL_NFM15CC_0402_0-5_TI
FL57 = EMIFILTER_IND: IND FERRITE BEAD CHIP 120E 6A 1206; Part Reference: FL57; Part_type: INDUCTOR; Mfr_name: MURATA; Mistral Part No: 130022090033-R; Custom_Duty: 24%; Customs_HS_Code: 85437099; Wattage: NA; Project: J7AHP_EVM; Value: 120E; PCB Footprint: EMIFIL_BLM31KN_1206_1-8; Footprint Path: Y:\MIS_DATABASE\Library\ALTIUM_TOOL\PCB_FOOTPRINTS\Altium_Footprint_Lib.PcbLib; Library Path: Y:\MIS_DATABASE\Library\ALTIUM_TOOL\SCHEMATICS_PARTS\MS_FILTER_Library.schlib; MECHANICAL 3D STEP FILE: EMIFIL_BLM31KN_1206_1-8; Chkd/date: PRAVEEN/140922; Crtd /date: PRAVEEN/140922; Datasheet: Y:\MIS_DATABASE\DATASHEETS\DISCRETES\INDUCTORS\BLM31KNXXXSH1L.PDF; Temperature: -55°C+125°C; Weight: 41mg; Height: 1.80MM; Library Ref: EMIFILTER_IND; Distributor_part_number: 490-16524-1-ND; Distributor_name: DIGIKEY; Voltage: NA; Tolerance: NA; Footprint Ref: EMIFIL_BLM31KN_1206_1-8
FL61 = EMIFILTER_IND: IND FERRITE BEAD CHIP 120E 6A 1206; Part Reference: FL61; Mistral Part No: 130022090033-R; Mfr_name: MURATA; Part_type: INDUCTOR; Project: J7AHP_EVM; Tolerance: NA; Customs_HS_Code: 85437099; Custom_Duty: 24%; Value: 120E; PCB Footprint: EMIFIL_BLM31KN_1206_1-8; Footprint Ref: EMIFIL_BLM31KN_1206_1-8; Voltage: NA; Wattage: NA; Distributor_name: DIGIKEY; Distributor_part_number: 490-16524-1-ND; Library Ref: EMIFILTER_IND; Height: 1.80MM; Weight: 41mg; Temperature: -55°C+125°C; Datasheet: Y:\MIS_DATABASE\DATASHEETS\DISCRETES\INDUCTORS\BLM31KNXXXSH1L.PDF; Crtd /date: PRAVEEN/140922; Chkd/date: PRAVEEN/140922; MECHANICAL 3D STEP FILE: EMIFIL_BLM31KN_1206_1-8; Library Path: Y:\MIS_DATABASE\Library\ALTIUM_TOOL\SCHEMATICS_PARTS\MS_FILTER_Library.schlib; Footprint Path: Y:\MIS_DATABASE\Library\ALTIUM_TOOL\PCB_FOOTPRINTS\Altium_Footprint_Lib.PcbLib
FL73 = CAP_NFM_TI: PASSIVE FILTER EMI 1uF 4V AUTO 0402; Part Reference: FL73; Mfr_part_number: NFM15HC105D0G_TI; Mfr_name: MURATA; Mistral Part No: 130018100050; Custom_Duty: 15%; Customs_HS_Code: 85412900; Wattage: NA; Project: TI_J7ES_EVM_SOM; Value: 1uF; Footprint Path: Y:\MIS_DATABASE\Library\ALTIUM_TOOL\PCB_FOOTPRINTS\Altium_Footprint_Lib.PcbLib; Library Path: Y:\MIS_DATABASE\Library\ALTIUM_TOOL\SCHEMATICS_PARTS\MS_FILTER_Library.schlib; MECHANICAL 3D STEP FILE: EMIFIL_NFM15CC_0402_0-5_TI; RoHS: NA; Chkd/date: MANIRAJA/251018; Crtd /date: ALVY/251018; Datasheet: Y:\MIS_DATABASE\DATASHEETS\DISCRETES\INDUCTORS\NFM15CC223C1A3.PDF; Temperature: NA; Weight: NA; Height: 0.50MM; PCB Footprint: EMIFIL_NFM15CC_0402_0-5_TI; Library Ref: CAP_NFM_TI; Distributor_part_number: NA; Distributor_name: NA; Package: 0402; Voltage: 4V; Tolerance: NA; Part_type: FILTER; Footprint Ref: EMIFIL_NFM15CC_0402_0-5_TI
FL79 = CAP_NFM_TI: PASSIVE FILTER EMI 1uF 4V AUTO 0402; Part Reference: FL79; Mfr_part_number: NFM15HC105D0G_TI; Mfr_name: MURATA; Mistral Part No: 130018100050; Custom_Duty: 15%; Customs_HS_Code: 85412900; Wattage: NA; Project: TI_J7ES_EVM_SOM; Value: 1uF; Footprint Path: Y:\MIS_DATABASE\Library\ALTIUM_TOOL\PCB_FOOTPRINTS\Altium_Footprint_Lib.PcbLib; Library Path: Y:\MIS_DATABASE\Library\ALTIUM_TOOL\SCHEMATICS_PARTS\MS_FILTER_Library.schlib; MECHANICAL 3D STEP FILE: EMIFIL_NFM15CC_0402_0-5_TI; RoHS: NA; Chkd/date: MANIRAJA/251018; Crtd /date: ALVY/251018; Datasheet: Y:\MIS_DATABASE\DATASHEETS\DISCRETES\INDUCTORS\NFM15CC223C1A3.PDF; Temperature: NA; Weight: NA; Height: 0.50MM; PCB Footprint: EMIFIL_NFM15CC_0402_0-5_TI; Library Ref: CAP_NFM_TI; Distributor_part_number: NA; Distributor_name: NA; Package: 0402; Voltage: 4V; Tolerance: NA; Part_type: FILTER; Footprint Ref: EMIFIL_NFM15CC_0402_0-5_TI
FL80 = CAP_NFM_TI: PASSIVE FILTER EMI 1uF 4V AUTO 0402; Part Reference: FL80; Mfr_part_number: NFM15HC105D0G_TI; Mfr_name: MURATA; Mistral Part No: 130018100050; Custom_Duty: 15%; Customs_HS_Code: 85412900; Wattage: NA; Project: TI_J7ES_EVM_SOM; Value: 1uF; Footprint Path: Y:\MIS_DATABASE\Library\ALTIUM_TOOL\PCB_FOOTPRINTS\Altium_Footprint_Lib.PcbLib; Library Path: Y:\MIS_DATABASE\Library\ALTIUM_TOOL\SCHEMATICS_PARTS\MS_FILTER_Library.schlib; MECHANICAL 3D STEP FILE: EMIFIL_NFM15CC_0402_0-5_TI; RoHS: NA; Chkd/date: MANIRAJA/251018; Crtd /date: ALVY/251018; Datasheet: Y:\MIS_DATABASE\DATASHEETS\DISCRETES\INDUCTORS\NFM15CC223C1A3.PDF; Temperature: NA; Weight: NA; Height: 0.50MM; PCB Footprint: EMIFIL_NFM15CC_0402_0-5_TI; Library Ref: CAP_NFM_TI; Distributor_part_number: NA; Distributor_name: NA; Package: 0402; Voltage: 4V; Tolerance: NA; Part_type: FILTER; Footprint Ref: EMIFIL_NFM15CC_0402_0-5_TI
FL81 = CAP_NFM_TI: PASSIVE FILTER EMI 1uF 4V AUTO 0402; Part Reference: FL81; Mfr_part_number: NFM15HC105D0G_TI; Mfr_name: MURATA; Mistral Part No: 130018100050; Custom_Duty: 15%; Customs_HS_Code: 85412900; Wattage: NA; Project: TI_J7ES_EVM_SOM; Value: 1uF; Footprint Path: Y:\MIS_DATABASE\Library\ALTIUM_TOOL\PCB_FOOTPRINTS\Altium_Footprint_Lib.PcbLib; Library Path: Y:\MIS_DATABASE\Library\ALTIUM_TOOL\SCHEMATICS_PARTS\MS_FILTER_Library.schlib; MECHANICAL 3D STEP FILE: EMIFIL_NFM15CC_0402_0-5_TI; RoHS: NA; Chkd/date: MANIRAJA/251018; Crtd /date: ALVY/251018; Datasheet: Y:\MIS_DATABASE\DATASHEETS\DISCRETES\INDUCTORS\NFM15CC223C1A3.PDF; Temperature: NA; Weight: NA; Height: 0.50MM; PCB Footprint: EMIFIL_NFM15CC_0402_0-5_TI; Library Ref: CAP_NFM_TI; Distributor_part_number: NA; Distributor_name: NA; Package: 0402; Voltage: 4V; Tolerance: NA; Part_type: FILTER; Footprint Ref: EMIFIL_NFM15CC_0402_0-5_TI
FL82 = CAP_NFM_TI: PASSIVE FILTER EMI 1uF 4V AUTO 0402; Part Reference: FL82; Mfr_part_number: NFM15HC105D0G_TI; Mfr_name: MURATA; Mistral Part No: 130018100050; Custom_Duty: 15%; Customs_HS_Code: 85412900; Wattage: NA; Project: TI_J7ES_EVM_SOM; Value: 1uF; Footprint Path: Y:\MIS_DATABASE\Library\ALTIUM_TOOL\PCB_FOOTPRINTS\Altium_Footprint_Lib.PcbLib; Library Path: Y:\MIS_DATABASE\Library\ALTIUM_TOOL\SCHEMATICS_PARTS\MS_FILTER_Library.schlib; MECHANICAL 3D STEP FILE: EMIFIL_NFM15CC_0402_0-5_TI; RoHS: NA; Chkd/date: MANIRAJA/251018; Crtd /date: ALVY/251018; Datasheet: Y:\MIS_DATABASE\DATASHEETS\DISCRETES\INDUCTORS\NFM15CC223C1A3.PDF; Temperature: NA; Weight: NA; Height: 0.50MM; PCB Footprint: EMIFIL_NFM15CC_0402_0-5_TI; Library Ref: CAP_NFM_TI; Distributor_part_number: NA; Distributor_name: NA; Package: 0402; Voltage: 4V; Tolerance: NA; Part_type: FILTER; Footprint Ref: EMIFIL_NFM15CC_0402_0-5_TI
FL93 = CAP_NFM_TI: PASSIVE FILTER EMI 1uF 4V AUTO 0402; Part Reference: FL93; Mfr_part_number: NFM15HC105D0G_TI; Mfr_name: MURATA; Mistral Part No: 130018100050; Custom_Duty: 15%; Customs_HS_Code: 85412900; Wattage: NA; Project: TI_J7ES_EVM_SOM; Value: 1uF; Footprint Path: Y:\MIS_DATABASE\Library\ALTIUM_TOOL\PCB_FOOTPRINTS\Altium_Footprint_Lib.PcbLib; Library Path: Y:\MIS_DATABASE\Library\ALTIUM_TOOL\SCHEMATICS_PARTS\MS_FILTER_Library.schlib; MECHANICAL 3D STEP FILE: EMIFIL_NFM15CC_0402_0-5_TI; RoHS: NA; Chkd/date: MANIRAJA/251018; Crtd /date: ALVY/251018; Datasheet: Y:\MIS_DATABASE\DATASHEETS\DISCRETES\INDUCTORS\NFM15CC223C1A3.PDF; Temperature: NA; Weight: NA; Height: 0.50MM; PCB Footprint: EMIFIL_NFM15CC_0402_0-5_TI; Library Ref: CAP_NFM_TI; Distributor_part_number: NA; Distributor_name: NA; Package: 0402; Voltage: 4V; Tolerance: NA; Part_type: FILTER; Footprint Ref: EMIFIL_NFM15CC_0402_0-5_TI
FL94 = CAP_NFM_TI: PASSIVE FILTER EMI 1uF 4V AUTO 0402; Part Reference: FL94; Mfr_part_number: NFM15HC105D0G_TI; Mfr_name: MURATA; Mistral Part No: 130018100050; Custom_Duty: 15%; Customs_HS_Code: 85412900; Wattage: NA; Project: TI_J7ES_EVM_SOM; Value: 1uF; Footprint Path: Y:\MIS_DATABASE\Library\ALTIUM_TOOL\PCB_FOOTPRINTS\Altium_Footprint_Lib.PcbLib; Library Path: Y:\MIS_DATABASE\Library\ALTIUM_TOOL\SCHEMATICS_PARTS\MS_FILTER_Library.schlib; MECHANICAL 3D STEP FILE: EMIFIL_NFM15CC_0402_0-5_TI; RoHS: NA; Chkd/date: MANIRAJA/251018; Crtd /date: ALVY/251018; Datasheet: Y:\MIS_DATABASE\DATASHEETS\DISCRETES\INDUCTORS\NFM15CC223C1A3.PDF; Temperature: NA; Weight: NA; Height: 0.50MM; PCB Footprint: EMIFIL_NFM15CC_0402_0-5_TI; Library Ref: CAP_NFM_TI; Distributor_part_number: NA; Distributor_name: NA; Package: 0402; Voltage: 4V; Tolerance: NA; Part_type: FILTER; Footprint Ref: EMIFIL_NFM15CC_0402_0-5_TI
FL95 = CAP_NFM_TI: PASSIVE FILTER EMI 1uF 4V AUTO 0402; Part Reference: FL95; Mfr_part_number: NFM15HC105D0G_TI; Mfr_name: MURATA; Mistral Part No: 130018100050; Custom_Duty: 15%; Customs_HS_Code: 85412900; Wattage: NA; Project: TI_J7ES_EVM_SOM; Value: 1uF; Footprint Path: Y:\MIS_DATABASE\Library\ALTIUM_TOOL\PCB_FOOTPRINTS\Altium_Footprint_Lib.PcbLib; Library Path: Y:\MIS_DATABASE\Library\ALTIUM_TOOL\SCHEMATICS_PARTS\MS_FILTER_Library.schlib; MECHANICAL 3D STEP FILE: EMIFIL_NFM15CC_0402_0-5_TI; RoHS: NA; Chkd/date: MANIRAJA/251018; Crtd /date: ALVY/251018; Datasheet: Y:\MIS_DATABASE\DATASHEETS\DISCRETES\INDUCTORS\NFM15CC223C1A3.PDF; Temperature: NA; Weight: NA; Height: 0.50MM; PCB Footprint: EMIFIL_NFM15CC_0402_0-5_TI; Library Ref: CAP_NFM_TI; Distributor_part_number: NA; Distributor_name: NA; Package: 0402; Voltage: 4V; Tolerance: NA; Part_type: FILTER; Footprint Ref: EMIFIL_NFM15CC_0402_0-5_TI
FL96 = CAP_NFM_TI: PASSIVE FILTER EMI 1uF 4V AUTO 0402; Part Reference: FL96; Mfr_part_number: NFM15HC105D0G_TI; Mfr_name: MURATA; Mistral Part No: 130018100050; Custom_Duty: 15%; Customs_HS_Code: 85412900; Wattage: NA; Project: TI_J7ES_EVM_SOM; Value: 1uF; Footprint Path: Y:\MIS_DATABASE\Library\ALTIUM_TOOL\PCB_FOOTPRINTS\Altium_Footprint_Lib.PcbLib; Library Path: Y:\MIS_DATABASE\Library\ALTIUM_TOOL\SCHEMATICS_PARTS\MS_FILTER_Library.schlib; MECHANICAL 3D STEP FILE: EMIFIL_NFM15CC_0402_0-5_TI; RoHS: NA; Chkd/date: MANIRAJA/251018; Crtd /date: ALVY/251018; Datasheet: Y:\MIS_DATABASE\DATASHEETS\DISCRETES\INDUCTORS\NFM15CC223C1A3.PDF; Temperature: NA; Weight: NA; Height: 0.50MM; PCB Footprint: EMIFIL_NFM15CC_0402_0-5_TI; Library Ref: CAP_NFM_TI; Distributor_part_number: NA; Distributor_name: NA; Package: 0402; Voltage: 4V; Tolerance: NA; Part_type: FILTER; Footprint Ref: EMIFIL_NFM15CC_0402_0-5_TI
FL97 = CAP_NFM_TI: PASSIVE FILTER EMI 1uF 4V AUTO 0402; Part Reference: FL97; Mfr_part_number: NFM15HC105D0G_TI; Mfr_name: MURATA; Mistral Part No: 130018100050; Custom_Duty: 15%; Customs_HS_Code: 85412900; Wattage: NA; Project: TI_J7ES_EVM_SOM; Value: 1uF; Footprint Path: Y:\MIS_DATABASE\Library\ALTIUM_TOOL\PCB_FOOTPRINTS\Altium_Footprint_Lib.PcbLib; Library Path: Y:\MIS_DATABASE\Library\ALTIUM_TOOL\SCHEMATICS_PARTS\MS_FILTER_Library.schlib; MECHANICAL 3D STEP FILE: EMIFIL_NFM15CC_0402_0-5_TI; RoHS: NA; Chkd/date: MANIRAJA/251018; Crtd /date: ALVY/251018; Datasheet: Y:\MIS_DATABASE\DATASHEETS\DISCRETES\INDUCTORS\NFM15CC223C1A3.PDF; Temperature: NA; Weight: NA; Height: 0.50MM; PCB Footprint: EMIFIL_NFM15CC_0402_0-5_TI; Library Ref: CAP_NFM_TI; Distributor_part_number: NA; Distributor_name: NA; Package: 0402; Voltage: 4V; Tolerance: NA; Part_type: FILTER; Footprint Ref: EMIFIL_NFM15CC_0402_0-5_TI
FL98 = CAP_NFM_TI: PASSIVE FILTER EMI 1uF 4V AUTO 0402; Part Reference: FL98; Mfr_part_number: NFM15HC105D0G_TI; Mfr_name: MURATA; Mistral Part No: 130018100050; Custom_Duty: 15%; Customs_HS_Code: 85412900; Wattage: NA; Project: TI_J7ES_EVM_SOM; Value: 1uF; Footprint Path: Y:\MIS_DATABASE\Library\ALTIUM_TOOL\PCB_FOOTPRINTS\Altium_Footprint_Lib.PcbLib; Library Path: Y:\MIS_DATABASE\Library\ALTIUM_TOOL\SCHEMATICS_PARTS\MS_FILTER_Library.schlib; MECHANICAL 3D STEP FILE: EMIFIL_NFM15CC_0402_0-5_TI; RoHS: NA; Chkd/date: MANIRAJA/251018; Crtd /date: ALVY/251018; Datasheet: Y:\MIS_DATABASE\DATASHEETS\DISCRETES\INDUCTORS\NFM15CC223C1A3.PDF; Temperature: NA; Weight: NA; Height: 0.50MM; PCB Footprint: EMIFIL_NFM15CC_0402_0-5_TI; Library Ref: CAP_NFM_TI; Distributor_part_number: NA; Distributor_name: NA; Package: 0402; Voltage: 4V; Tolerance: NA; Part_type: FILTER; Footprint Ref: EMIFIL_NFM15CC_0402_0-5_TI
FL99 = CAP_NFM_TI: PASSIVE FILTER EMI 1uF 4V AUTO 0402; Part Reference: FL99; Mfr_part_number: NFM15HC105D0G_TI; Mfr_name: MURATA; Mistral Part No: 130018100050; Custom_Duty: 15%; Customs_HS_Code: 85412900; Wattage: NA; Project: TI_J7ES_EVM_SOM; Value: 1uF; Footprint Path: Y:\MIS_DATABASE\Library\ALTIUM_TOOL\PCB_FOOTPRINTS\Altium_Footprint_Lib.PcbLib; Library Path: Y:\MIS_DATABASE\Library\ALTIUM_TOOL\SCHEMATICS_PARTS\MS_FILTER_Library.schlib; MECHANICAL 3D STEP FILE: EMIFIL_NFM15CC_0402_0-5_TI; RoHS: NA; Chkd/date: MANIRAJA/251018; Crtd /date: ALVY/251018; Datasheet: Y:\MIS_DATABASE\DATASHEETS\DISCRETES\INDUCTORS\NFM15CC223C1A3.PDF; Temperature: NA; Weight: NA; Height: 0.50MM; PCB Footprint: EMIFIL_NFM15CC_0402_0-5_TI; Library Ref: CAP_NFM_TI; Distributor_part_number: NA; Distributor_name: NA; Package: 0402; Voltage: 4V; Tolerance: NA; Part_type: FILTER; Footprint Ref: EMIFIL_NFM15CC_0402_0-5_TI
FL103 = CAP_NFM_TI: PASSIVE FILTER EMI 1uF 4V AUTO 0402; Part Reference: FL103; Mfr_part_number: NFM15HC105D0G_TI; Mfr_name: MURATA; Mistral Part No: 130018100050; Custom_Duty: 15%; Customs_HS_Code: 85412900; Wattage: NA; Project: TI_J7ES_EVM_SOM; Value: 1uF; Footprint Path: Y:\MIS_DATABASE\Library\ALTIUM_TOOL\PCB_FOOTPRINTS\Altium_Footprint_Lib.PcbLib; Library Path: Y:\MIS_DATABASE\Library\ALTIUM_TOOL\SCHEMATICS_PARTS\MS_FILTER_Library.schlib; MECHANICAL 3D STEP FILE: EMIFIL_NFM15CC_0402_0-5_TI; RoHS: NA; Chkd/date: MANIRAJA/251018; Crtd /date: ALVY/251018; Datasheet: Y:\MIS_DATABASE\DATASHEETS\DISCRETES\INDUCTORS\NFM15CC223C1A3.PDF; Temperature: NA; Weight: NA; Height: 0.50MM; PCB Footprint: EMIFIL_NFM15CC_0402_0-5_TI; Library Ref: CAP_NFM_TI; Distributor_part_number: NA; Distributor_name: NA; Package: 0402; Voltage: 4V; Tolerance: NA; Part_type: FILTER; Footprint Ref: EMIFIL_NFM15CC_0402_0-5_TI
FL104 = CAP_NFM_TI: PASSIVE FILTER EMI 1uF 4V AUTO 0402; Part Reference: FL104; Mfr_part_number: NFM15HC105D0G_TI; Mfr_name: MURATA; Mistral Part No: 130018100050; Custom_Duty: 15%; Customs_HS_Code: 85412900; Wattage: NA; Project: TI_J7ES_EVM_SOM; Value: 1uF; Footprint Path: Y:\MIS_DATABASE\Library\ALTIUM_TOOL\PCB_FOOTPRINTS\Altium_Footprint_Lib.PcbLib; Library Path: Y:\MIS_DATABASE\Library\ALTIUM_TOOL\SCHEMATICS_PARTS\MS_FILTER_Library.schlib; MECHANICAL 3D STEP FILE: EMIFIL_NFM15CC_0402_0-5_TI; RoHS: NA; Chkd/date: MANIRAJA/251018; Crtd /date: ALVY/251018; Datasheet: Y:\MIS_DATABASE\DATASHEETS\DISCRETES\INDUCTORS\NFM15CC223C1A3.PDF; Temperature: NA; Weight: NA; Height: 0.50MM; PCB Footprint: EMIFIL_NFM15CC_0402_0-5_TI; Library Ref: CAP_NFM_TI; Distributor_part_number: NA; Distributor_name: NA; Package: 0402; Voltage: 4V; Tolerance: NA; Part_type: FILTER; Footprint Ref: EMIFIL_NFM15CC_0402_0-5_TI
FL105 = CAP_NFM_TI: PASSIVE FILTER EMI 10uF 4V AUTO 0603; Part Reference: FL105; Mfr_part_number: NFM18HC106D0G_TI; Mfr_name: MURATA; Mistral Part No: 130018100049; Custom_Duty: 15%; Customs_HS_Code: 85412900; Wattage: NA; Project: TI_J7ES_EVM_SOM; Value: 10uF; Footprint Path: Y:\MIS_DATABASE\Library\ALTIUM_TOOL\PCB_FOOTPRINTS\Altium_Footprint_Lib.PcbLib; Library Path: Y:\MIS_DATABASE\Library\ALTIUM_TOOL\SCHEMATICS_PARTS\MS_FILTER_Library.schlib; MECHANICAL 3D STEP FILE: EMIFIL_NFM18C_0603_0-7_TI; RoHS: NA; Chkd/date: MANIRAJA/251018; Crtd /date: ALVY/251018; Datasheet: Y:\MIS_DATABASE\DATASHEETS\DISCRETES\INDUCTORS\NFM18HC-SER.PDF; Temperature: NA; Weight: NA; Height: 0.70MM; PCB Footprint: EMIFIL_NFM18C_0603_0-7_TI; Library Ref: CAP_NFM_TI; Distributor_part_number: NA; Distributor_name: NA; Package: 0603; Voltage: 4V; Tolerance: NA; Part_type: FILTER; Footprint Ref: EMIFIL_NFM18C_0603_0-7_TI
FL106 = CAP_NFM_TI: PASSIVE FILTER EMI 1uF 4V AUTO 0402; Part Reference: FL106; Mfr_part_number: NFM15HC105D0G_TI; Mfr_name: MURATA; Mistral Part No: 130018100050; Custom_Duty: 15%; Customs_HS_Code: 85412900; Wattage: NA; Project: TI_J7ES_EVM_SOM; Value: 1uF; Footprint Path: Y:\MIS_DATABASE\Library\ALTIUM_TOOL\PCB_FOOTPRINTS\Altium_Footprint_Lib.PcbLib; Library Path: Y:\MIS_DATABASE\Library\ALTIUM_TOOL\SCHEMATICS_PARTS\MS_FILTER_Library.schlib; MECHANICAL 3D STEP FILE: EMIFIL_NFM15CC_0402_0-5_TI; RoHS: NA; Chkd/date: MANIRAJA/251018; Crtd /date: ALVY/251018; Datasheet: Y:\MIS_DATABASE\DATASHEETS\DISCRETES\INDUCTORS\NFM15CC223C1A3.PDF; Temperature: NA; Weight: NA; Height: 0.50MM; PCB Footprint: EMIFIL_NFM15CC_0402_0-5_TI; Library Ref: CAP_NFM_TI; Distributor_part_number: NA; Distributor_name: NA; Package: 0402; Voltage: 4V; Tolerance: NA; Part_type: FILTER; Footprint Ref: EMIFIL_NFM15CC_0402_0-5_TI
FL107 = CAP_NFM_TI: PASSIVE FILTER EMI 1uF 4V AUTO 0402; Part Reference: FL107; Mfr_part_number: NFM15HC105D0G_TI; Mfr_name: MURATA; Mistral Part No: 130018100050; Custom_Duty: 15%; Customs_HS_Code: 85412900; Wattage: NA; Project: TI_J7ES_EVM_SOM; Value: 1uF; Footprint Path: Y:\MIS_DATABASE\Library\ALTIUM_TOOL\PCB_FOOTPRINTS\Altium_Footprint_Lib.PcbLib; Library Path: Y:\MIS_DATABASE\Library\ALTIUM_TOOL\SCHEMATICS_PARTS\MS_FILTER_Library.schlib; MECHANICAL 3D STEP FILE: EMIFIL_NFM15CC_0402_0-5_TI; RoHS: NA; Chkd/date: MANIRAJA/251018; Crtd /date: ALVY/251018; Datasheet: Y:\MIS_DATABASE\DATASHEETS\DISCRETES\INDUCTORS\NFM15CC223C1A3.PDF; Temperature: NA; Weight: NA; Height: 0.50MM; PCB Footprint: EMIFIL_NFM15CC_0402_0-5_TI; Library Ref: CAP_NFM_TI; Distributor_part_number: NA; Distributor_name: NA; Package: 0402; Voltage: 4V; Tolerance: NA; Part_type: FILTER; Footprint Ref: EMIFIL_NFM15CC_0402_0-5_TI